# EAGLE design Circuit (EAGLE 6.4)
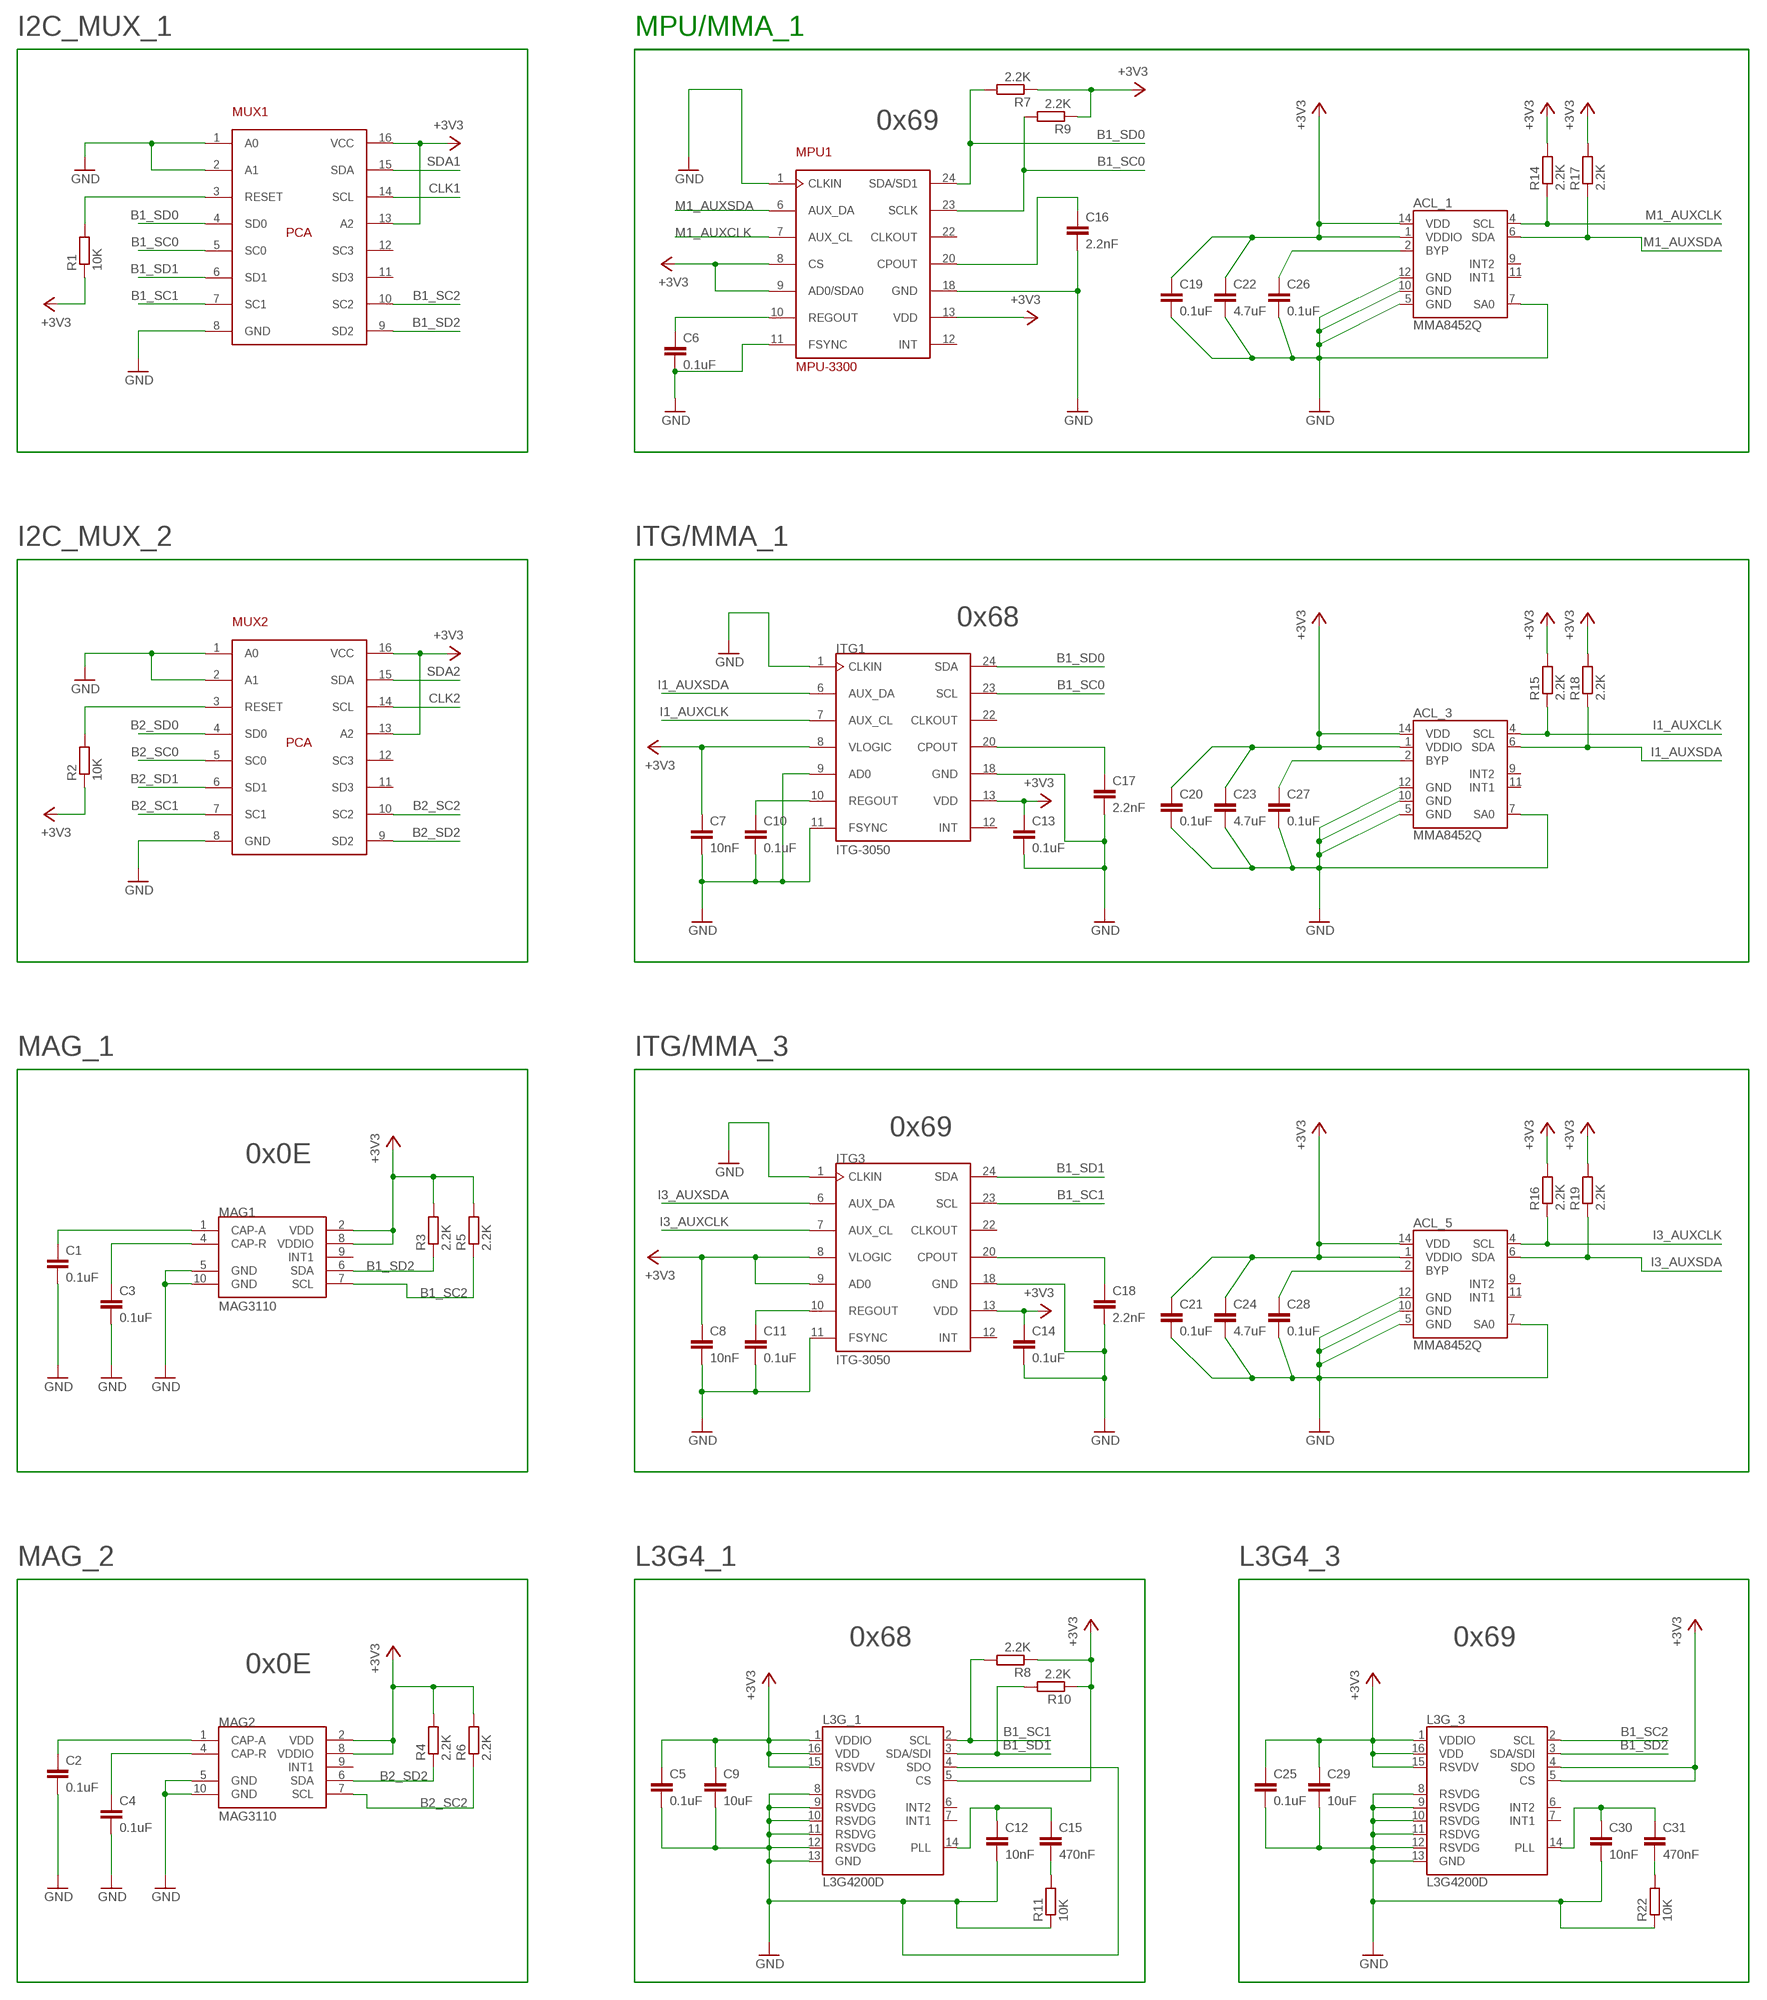
[diagram p0: schematic, sheet 1, part 1 of 2]
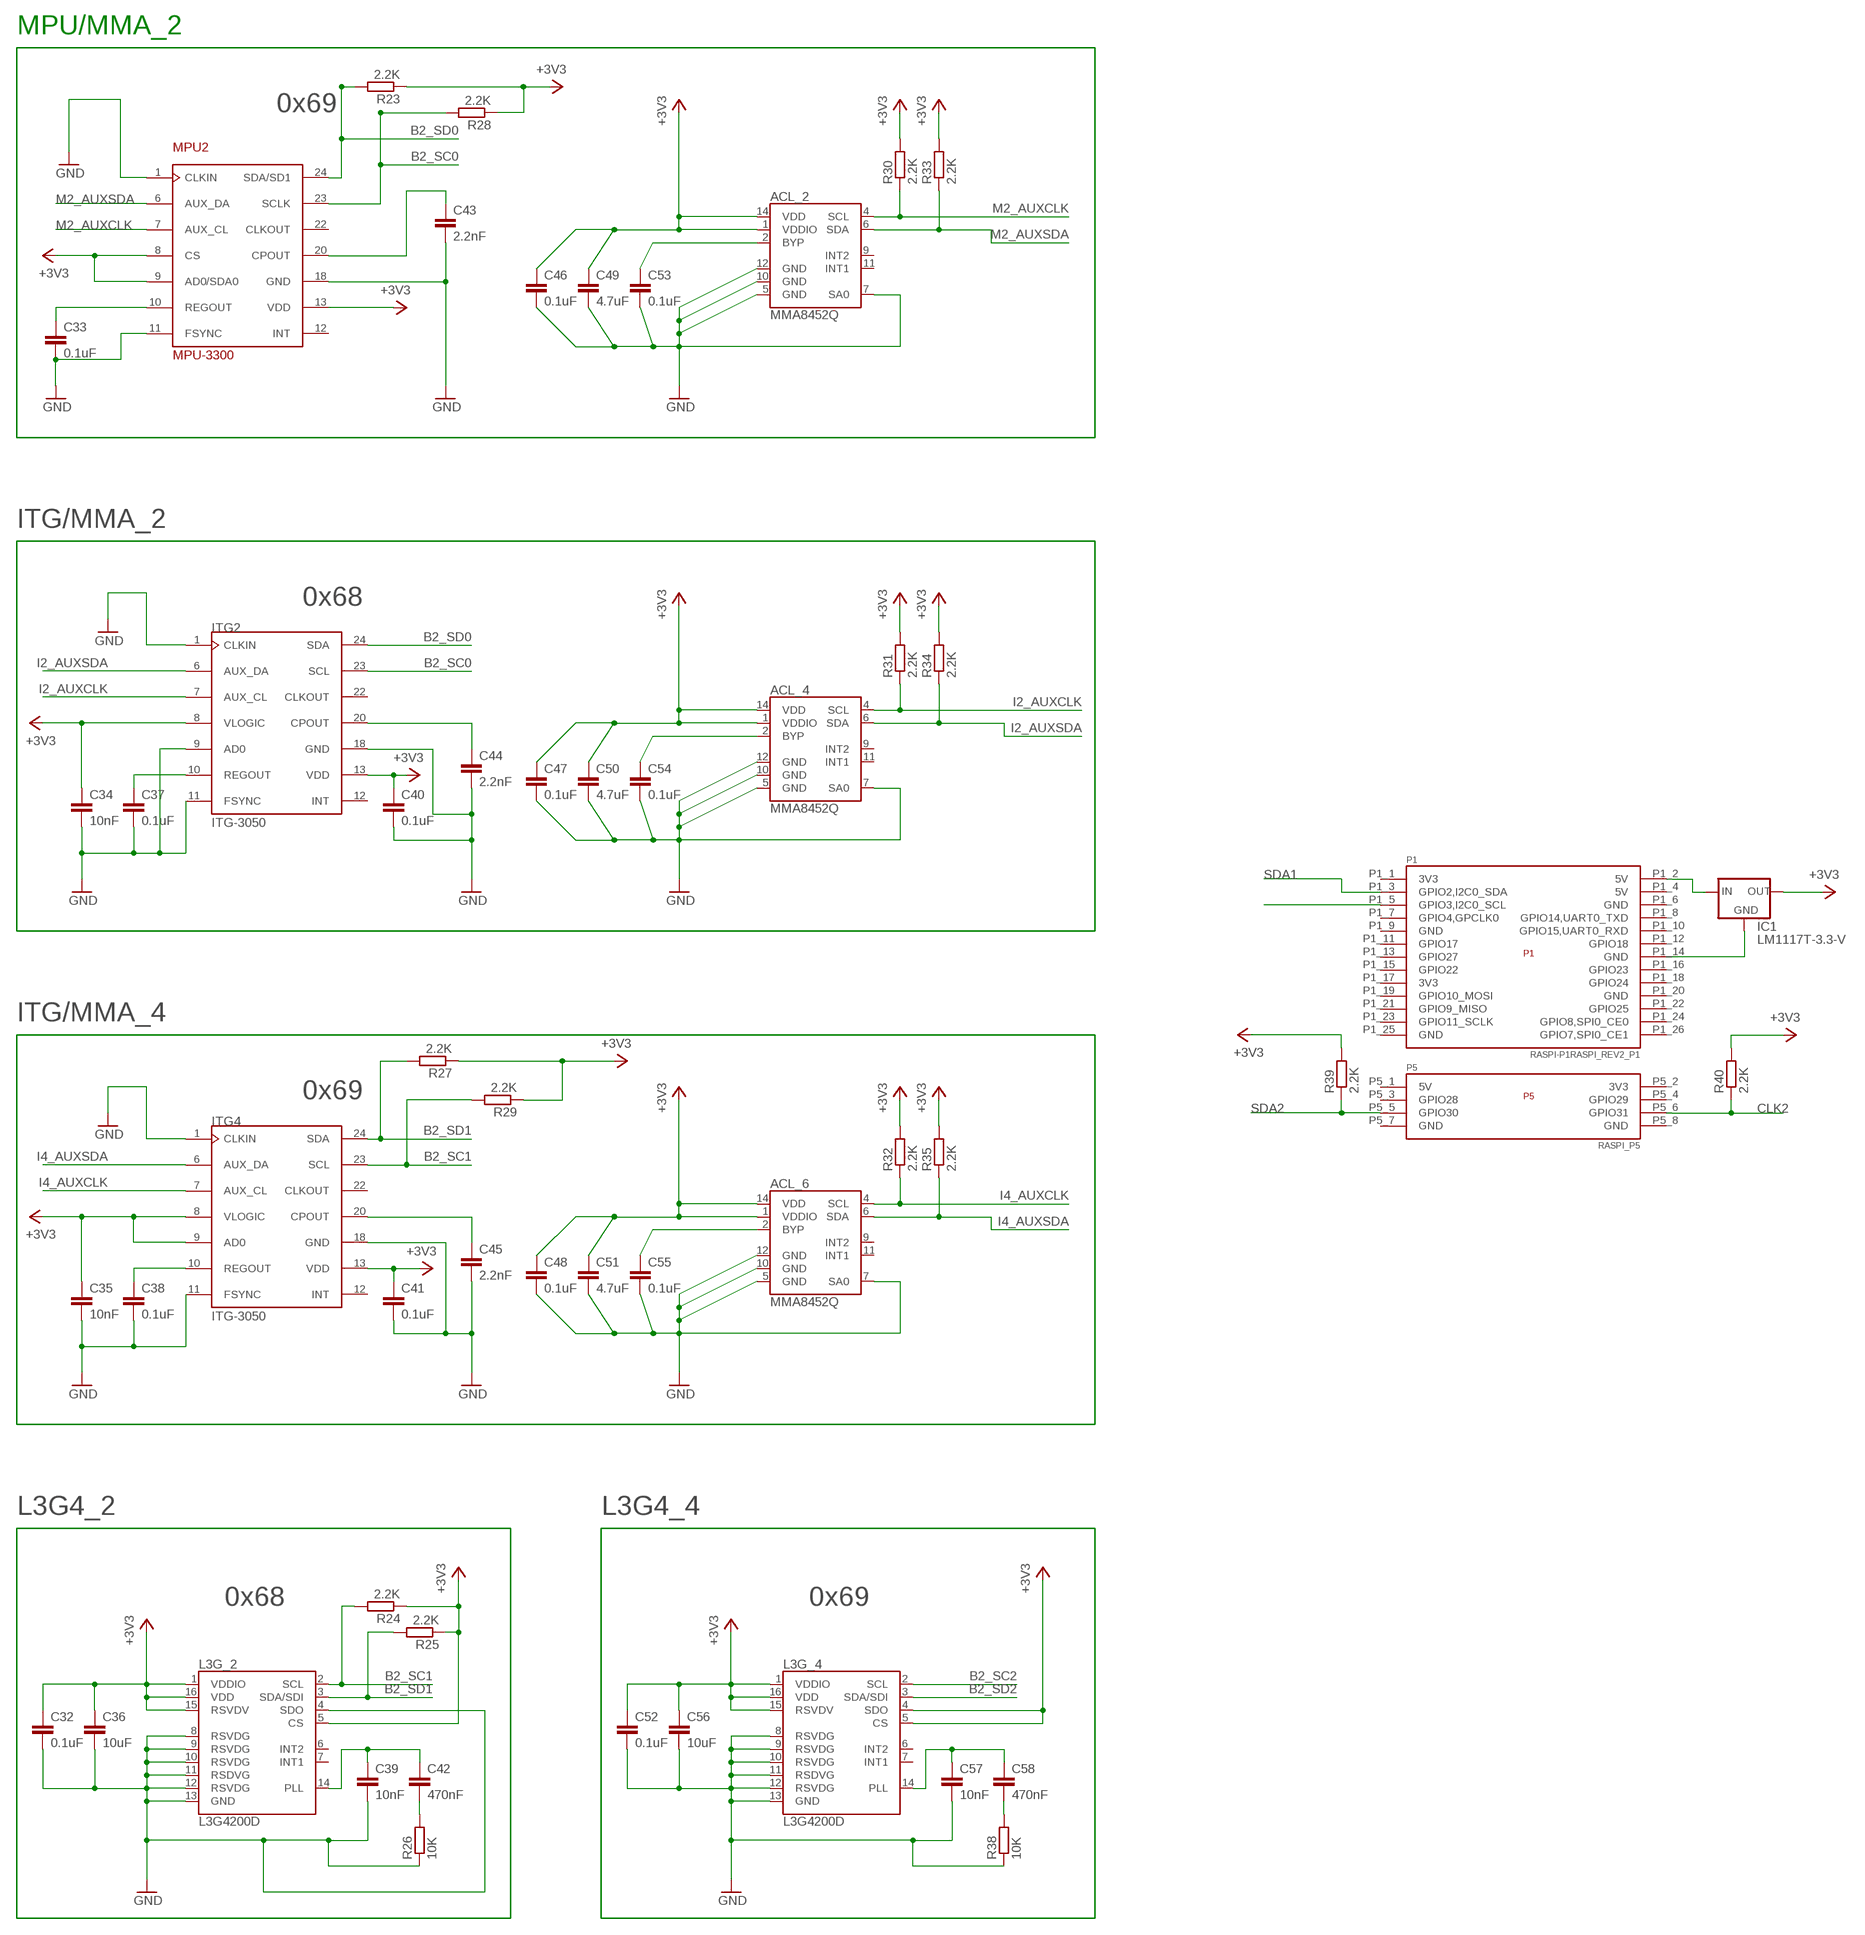
[diagram p1: schematic, sheet 1, part 2 of 2]

## Parts
ACL_1  MMA8452Q  [QFN-16_0.5MM]
ACL_2  MMA8452Q  [QFN-16_0.5MM]
ACL_3  MMA8452Q  [QFN-16_0.5MM]
ACL_4  MMA8452Q  [QFN-16_0.5MM]
ACL_5  MMA8452Q  [QFN-16_0.5MM]
ACL_6  MMA8452Q  [QFN-16_0.5MM]
C1  0.1uF  CAP0603-CAP  [0603-CAP]
C2  0.1uF  CAP0603-CAP  [0603-CAP]
C3  0.1uF  CAP0603-CAP  [0603-CAP]
C4  0.1uF  CAP0603-CAP  [0603-CAP]
C5  0.1uF  CAP0603-CAP  [0603-CAP]
C6  0.1uF  CAP0603-CAP  [0603-CAP]
C7  10nF  CAP0603-CAP  [0603-CAP]
C8  10nF  CAP0603-CAP  [0603-CAP]
C9  10uF  CAP0603-CAP  [0603-CAP]
C10  0.1uF  CAP0603-CAP  [0603-CAP]
C11  0.1uF  CAP0603-CAP  [0603-CAP]
C12  10nF  CAP0603-CAP  [0603-CAP]
C13  0.1uF  CAP0603-CAP  [0603-CAP]
C14  0.1uF  CAP0603-CAP  [0603-CAP]
C15  470nF  CAP0603-CAP  [0603-CAP]
C16  2.2nF  CAP0603-CAP  [0603-CAP]
C17  2.2nF  CAP0603-CAP  [0603-CAP]
C18  2.2nF  CAP0603-CAP  [0603-CAP]
C19  0.1uF  CAP0603-CAP  [0603-CAP]
C20  0.1uF  CAP0603-CAP  [0603-CAP]
C21  0.1uF  CAP0603-CAP  [0603-CAP]
C22  4.7uF  CAP0603-CAP  [0603-CAP]
C23  4.7uF  CAP0603-CAP  [0603-CAP]
C24  4.7uF  CAP0603-CAP  [0603-CAP]
C25  0.1uF  CAP0603-CAP  [0603-CAP]
C26  0.1uF  CAP0603-CAP  [0603-CAP]
C27  0.1uF  CAP0603-CAP  [0603-CAP]
C28  0.1uF  CAP0603-CAP  [0603-CAP]
C29  10uF  CAP0603-CAP  [0603-CAP]
C30  10nF  CAP0603-CAP  [0603-CAP]
C31  470nF  CAP0603-CAP  [0603-CAP]
C32  0.1uF  CAP0603-CAP  [0603-CAP]
C33  0.1uF  CAP0603-CAP  [0603-CAP]
C34  10nF  CAP0603-CAP  [0603-CAP]
C35  10nF  CAP0603-CAP  [0603-CAP]
C36  10uF  CAP0603-CAP  [0603-CAP]
C37  0.1uF  CAP0603-CAP  [0603-CAP]
C38  0.1uF  CAP0603-CAP  [0603-CAP]
C39  10nF  CAP0603-CAP  [0603-CAP]
C40  0.1uF  CAP0603-CAP  [0603-CAP]
C41  0.1uF  CAP0603-CAP  [0603-CAP]
C42  470nF  CAP0603-CAP  [0603-CAP]
C43  2.2nF  CAP0603-CAP  [0603-CAP]
C44  2.2nF  CAP0603-CAP  [0603-CAP]
C45  2.2nF  CAP0603-CAP  [0603-CAP]
C46  0.1uF  CAP0603-CAP  [0603-CAP]
C47  0.1uF  CAP0603-CAP  [0603-CAP]
C48  0.1uF  CAP0603-CAP  [0603-CAP]
C49  4.7uF  CAP0603-CAP  [0603-CAP]
C50  4.7uF  CAP0603-CAP  [0603-CAP]
C51  4.7uF  CAP0603-CAP  [0603-CAP]
C52  0.1uF  CAP0603-CAP  [0603-CAP]
C53  0.1uF  CAP0603-CAP  [0603-CAP]
C54  0.1uF  CAP0603-CAP  [0603-CAP]
C55  0.1uF  CAP0603-CAP  [0603-CAP]
C56  10uF  CAP0603-CAP  [0603-CAP]
C57  10nF  CAP0603-CAP  [0603-CAP]
C58  470nF  CAP0603-CAP  [0603-CAP]
IC1  LM1117T-3.3-V  [TO220V]
ITG1  ITG-3050  [QFN-24-4MM2]
ITG2  ITG-3050  [QFN-24-4MM2]
ITG3  ITG-3050  [QFN-24-4MM2]
ITG4  ITG-3050  [QFN-24-4MM2]
L3G_1  L3G4200D  [LGA16-4X4]
L3G_2  L3G4200D  [LGA16-4X4]
L3G_3  L3G4200D  [LGA16-4X4]
L3G_4  L3G4200D  [LGA16-4X4]
MAG1  MAG3110  [DFN-10]
MAG2  MAG3110  [DFN-10]
MPU1  MPU-3300  [QFN-24-4MM2]
MPU2  MPU-3300  [QFN-24-4MM2]
MUX1  PCA9546A  [TSSOP16]
MUX2  PCA9546A  [TSSOP16]
P1  RASPI-P1RASPI_REV2_P1  [RASPBERRY-PI_REV2]
P5  RASPI_P5  [RASPI_P5]
R1  10K  R-EU_R0603  [R0603]
R2  10K  R-EU_R0603  [R0603]
R3  2.2K  R-EU_R0603  [R0603]
R4  2.2K  R-EU_R0603  [R0603]
R5  2.2K  R-EU_R0603  [R0603]
R6  2.2K  R-EU_R0603  [R0603]
R7  2.2K  R-EU_R0603  [R0603]
R8  2.2K  R-EU_R0603  [R0603]
R9  2.2K  R-EU_R0603  [R0603]
R10  2.2K  R-EU_R0603  [R0603]
R11  10K  R-EU_R0603  [R0603]
R14  2.2K  R-EU_R0603  [R0603]
R15  2.2K  R-EU_R0603  [R0603]
R16  2.2K  R-EU_R0603  [R0603]
R17  2.2K  R-EU_R0603  [R0603]
R18  2.2K  R-EU_R0603  [R0603]
R19  2.2K  R-EU_R0603  [R0603]
R22  10K  R-EU_R0603  [R0603]
R23  2.2K  R-EU_R0603  [R0603]
R24  2.2K  R-EU_R0603  [R0603]
R25  2.2K  R-EU_R0603  [R0603]
R26  10K  R-EU_R0603  [R0603]
R27  2.2K  R-EU_R0603  [R0603]
R28  2.2K  R-EU_R0603  [R0603]
R29  2.2K  R-EU_R0603  [R0603]
R30  2.2K  R-EU_R0603  [R0603]
R31  2.2K  R-EU_R0603  [R0603]
R32  2.2K  R-EU_R0603  [R0603]
R33  2.2K  R-EU_R0603  [R0603]
R34  2.2K  R-EU_R0603  [R0603]
R35  2.2K  R-EU_R0603  [R0603]
R38  10K  R-EU_R0603  [R0603]
R39  2.2K  R-EU_R0603  [R0603]
R40  2.2K  R-EU_R0603  [R0603]

## Nets
+3V3: ACL_1.1(VDDIO) ACL_1.14(VDD) ACL_2.1(VDDIO) ACL_2.14(VDD) ACL_3.1(VDDIO) ACL_3.14(VDD) ACL_4.1(VDDIO) ACL_4.14(VDD) ACL_5.1(VDDIO) ACL_5.14(VDD) ACL_6.1(VDDIO) ACL_6.14(VDD) C5.1 C7.1 C8.1 C9.1 C13.1 C14.1 C19.1 C20.1 C21.1 C22.1 C23.1 C24.1 C25.1 C29.1 C32.1 C34.1 C35.1 C36.1 C40.1 C41.1 C46.1 C47.1 C48.1 C49.1 C50.1 C51.1 C52.1 C56.1 IC1.2(OUT) ITG1.8(VLOGIC) ITG1.13(VDD) ITG2.8(VLOGIC) ITG2.13(VDD) ITG3.8(VLOGIC) ITG3.9(AD0) ITG3.13(VDD) ITG4.8(VLOGIC) ITG4.9(AD0) ITG4.13(VDD) L3G_1.1(VDDIO) L3G_1.5(CS) L3G_1.15(RSVDV) L3G_1.16(VDD) L3G_2.1(VDDIO) L3G_2.5(CS) L3G_2.15(RSVDV) L3G_2.16(VDD) L3G_3.1(VDDIO) L3G_3.4(SDO) L3G_3.5(CS) L3G_3.15(RSVDV) L3G_3.16(VDD) L3G_4.1(VDDIO) L3G_4.4(SDO) L3G_4.5(CS) L3G_4.15(RSVDV) L3G_4.16(VDD) MAG1.2(VDD) MAG1.8(VDDIO) MAG2.2(VDD) MAG2.8(VDDIO) MPU1.8(CS) MPU1.9(AD0/SDA0) MPU1.13(VDD) MPU2.8(CS) MPU2.9(AD0/SDA0) MPU2.13(VDD) MUX1.13(A2) MUX1.16(VCC) MUX2.13(A2) MUX2.16(VCC) R1.1 R2.1 R3.2 R4.2 R5.2 R6.2 R7.1 R8.1 R9.1 R10.1 R14.2 R15.2 R16.2 R17.2 R18.2 R19.2 R23.1 R24.1 R25.1 R27.1 R28.1 R29.1 R30.2 R31.2 R32.2 R33.2 R34.2 R35.2 R39.2 R40.2
B1_SC0: ITG1.23(SCL) MPU1.23(SCLK) MUX1.5(SC0) R9.2
B1_SC1: ITG3.23(SCL) L3G_1.2(SCL) MUX1.7(SC1) R8.2
B1_SC2: L3G_3.2(SCL) MAG1.7(SCL) MUX1.10(SC2) R5.1
B1_SD0: ITG1.24(SDA) MPU1.24(SDA/SD1) MUX1.4(SD0) R7.2
B1_SD1: ITG3.24(SDA) L3G_1.3(SDA/SDI) MUX1.6(SD1) R10.2
B1_SD2: L3G_3.3(SDA/SDI) MAG1.6(SDA) MUX1.9(SD2) R3.1
B2_SC0: ITG2.23(SCL) MPU2.23(SCLK) MUX2.5(SC0) R28.2
B2_SC1: ITG4.23(SCL) L3G_2.2(SCL) MUX2.7(SC1) R24.2 R29.2
B2_SC2: L3G_4.2(SCL) MAG2.7(SCL) MUX2.10(SC2) R6.1
B2_SD0: ITG2.24(SDA) MPU2.24(SDA/SD1) MUX2.4(SD0) R23.2
B2_SD1: ITG4.24(SDA) L3G_2.3(SDA/SDI) MUX2.6(SD1) R25.2 R27.2
B2_SD2: L3G_4.3(SDA/SDI) MAG2.6(SDA) MUX2.9(SD2) R4.1
CLK1: MUX1.14(SCL) P1.P1_5(GPIO3,I2C0_SCL)
CLK2: MUX2.14(SCL) P5.P5_6(GPIO31) R40.1
GND: ACL_1.5(GND) ACL_1.7(SA0) ACL_1.10(GND) ACL_1.12(GND) ACL_2.5(GND) ACL_2.7(SA0) ACL_2.10(GND) ACL_2.12(GND) ACL_3.5(GND) ACL_3.7(SA0) ACL_3.10(GND) ACL_3.12(GND) ACL_4.5(GND) ACL_4.7(SA0) ACL_4.10(GND) ACL_4.12(GND) ACL_5.5(GND) ACL_5.7(SA0) ACL_5.10(GND) ACL_5.12(GND) ACL_6.5(GND) ACL_6.7(SA0) ACL_6.10(GND) ACL_6.12(GND) C1.2 C2.2 C3.2 C4.2 C5.2 C6.2 C7.2 C8.2 C9.2 C10.2 C11.2 C12.2 C13.2 C14.2 C16.2 C17.2 C18.2 C19.2 C20.2 C21.2 C22.2 C23.2 C24.2 C25.2 C26.2 C27.2 C28.2 C29.2 C30.2 C32.2 C33.2 C34.2 C35.2 C36.2 C37.2 C38.2 C39.2 C40.2 C41.2 C43.2 C44.2 C45.2 C46.2 C47.2 C48.2 C49.2 C50.2 C51.2 C52.2 C53.2 C54.2 C55.2 C56.2 C57.2 IC1.1(GND) ITG1.1(CLKIN) ITG1.9(AD0) ITG1.11(FSYNC) ITG1.18(GND) ITG2.1(CLKIN) ITG2.9(AD0) ITG2.11(FSYNC) ITG2.18(GND) ITG3.1(CLKIN) ITG3.11(FSYNC) ITG3.18(GND) ITG4.1(CLKIN) ITG4.11(FSYNC) ITG4.18(GND) L3G_1.4(SDO) L3G_1.8(RSVDG) L3G_1.9(RSVDG) L3G_1.10(RSVDG) L3G_1.11(RSDVG) L3G_1.12(RSVDG) L3G_1.13(GND) L3G_2.4(SDO) L3G_2.8(RSVDG) L3G_2.9(RSVDG) L3G_2.10(RSVDG) L3G_2.11(RSDVG) L3G_2.12(RSVDG) L3G_2.13(GND) L3G_3.8(RSVDG) L3G_3.9(RSVDG) L3G_3.10(RSVDG) L3G_3.11(RSDVG) L3G_3.12(RSVDG) L3G_3.13(GND) L3G_4.8(RSVDG) L3G_4.9(RSVDG) L3G_4.10(RSVDG) L3G_4.11(RSDVG) L3G_4.12(RSVDG) L3G_4.13(GND) MAG1.5(GND) MAG1.10(GND) MAG2.5(GND) MAG2.10(GND) MPU1.1(CLKIN) MPU1.11(FSYNC) MPU1.18(GND) MPU2.1(CLKIN) MPU2.11(FSYNC) MPU2.18(GND) MUX1.1(A0) MUX1.2(A1) MUX1.8(GND) MUX2.1(A0) MUX2.2(A1) MUX2.8(GND) P1.P1_14(GND) R11.1 R22.1 R26.1 R38.1
I1_AUXCLK: ACL_3.4(SCL) ITG1.7(AUX_CL) R15.1
I1_AUXSDA: ACL_3.6(SDA) ITG1.6(AUX_DA) R18.1
I2_AUXCLK: ACL_4.4(SCL) ITG2.7(AUX_CL) R31.1
I2_AUXSDA: ACL_4.6(SDA) ITG2.6(AUX_DA) R34.1
I3_AUXCLK: ACL_5.4(SCL) ITG3.7(AUX_CL) R16.1
I3_AUXSDA: ACL_5.6(SDA) ITG3.6(AUX_DA) R19.1
I4_AUXCLK: ACL_6.4(SCL) ITG4.7(AUX_CL) R32.1
I4_AUXSDA: ACL_6.6(SDA) ITG4.6(AUX_DA) R35.1
M1_AUXCLK: ACL_1.4(SCL) MPU1.7(AUX_CL) R14.1
M1_AUXSDA: ACL_1.6(SDA) MPU1.6(AUX_DA) R17.1
M2_AUXCLK: ACL_2.4(SCL) MPU2.7(AUX_CL) R30.1
M2_AUXSDA: ACL_2.6(SDA) MPU2.6(AUX_DA) R33.1
N$1: C16.1 MPU1.20(CPOUT)
N$2: C6.1 MPU1.10(REGOUT)
N$3: ACL_1.2(BYP) C26.1
N$5: ACL_2.2(BYP) C53.1
N$6: C43.1 MPU2.20(CPOUT)
N$7: C33.1 MPU2.10(REGOUT)
N$9: ACL_3.2(BYP) C27.1
N$10: IC1.3(IN) P1.P1_2(5V)
N$13: C10.1 ITG1.10(REGOUT)
N$14: C17.1 ITG1.20(CPOUT)
N$15: ACL_4.2(BYP) C54.1
N$16: MUX2.3(RESET) R2.2
N$20: C37.1 ITG2.10(REGOUT)
N$21: C44.1 ITG2.20(CPOUT)
N$23: ACL_5.2(BYP) C28.1
N$27: C11.1 ITG3.10(REGOUT)
N$28: C18.1 ITG3.20(CPOUT)
N$30: ACL_6.2(BYP) C55.1
N$34: C38.1 ITG4.10(REGOUT)
N$35: C45.1 ITG4.20(CPOUT)
N$36: C30.1 C31.1 L3G_3.14(PLL)
N$38: C2.1 MAG2.1(CAP-A)
N$39: C12.1 C15.1 L3G_1.14(PLL)
N$40: C15.2 R11.2
N$41: C31.2 R22.2
N$42: MUX1.3(RESET) R1.2
N$45: C39.1 C42.1 L3G_2.14(PLL)
N$46: C42.2 R26.2
N$49: C4.1 MAG2.4(CAP-R)
N$50: C57.1 C58.1 L3G_4.14(PLL)
N$51: C58.2 R38.2
N$52: C1.1 MAG1.1(CAP-A)
N$53: C3.1 MAG1.4(CAP-R)
SDA1: MUX1.15(SDA) P1.P1_3(GPIO2,I2C0_SDA)
SDA2: MUX2.15(SDA) P5.P5_5(GPIO30) R39.1
Unconnected: ACL_1.9(INT2) ACL_1.11(INT1) ACL_2.9(INT2) ACL_2.11(INT1) ACL_3.9(INT2) ACL_3.11(INT1) ACL_4.9(INT2) ACL_4.11(INT1) ACL_5.9(INT2) ACL_5.11(INT1) ACL_6.9(INT2) ACL_6.11(INT1) ITG1.12(INT) ITG1.22(CLKOUT) ITG2.12(INT) ITG2.22(CLKOUT) ITG3.12(INT) ITG3.22(CLKOUT) ITG4.12(INT) ITG4.22(CLKOUT) L3G_1.6(INT2) L3G_1.7(INT1) L3G_2.6(INT2) L3G_2.7(INT1) L3G_3.6(INT2) L3G_3.7(INT1) L3G_4.6(INT2) L3G_4.7(INT1) MAG1.9(INT1) MAG2.9(INT1) MPU1.12(INT) MPU1.22(CLKOUT) MPU2.12(INT) MPU2.22(CLKOUT) MUX1.11(SD3) MUX1.12(SC3) MUX2.11(SD3) MUX2.12(SC3) P1.P1_1(3V3) P1.P1_4(5V) P1.P1_6(GND) P1.P1_7(GPIO4,GPCLK0) P1.P1_8(GPIO14,UART0_TXD) P1.P1_9(GND) P1.P1_10(GPIO15,UART0_RXD) P1.P1_11(GPIO17) P1.P1_12(GPIO18) P1.P1_13(GPIO27) P1.P1_15(GPIO22) P1.P1_16(GPIO23) P1.P1_17(3V3) P1.P1_18(GPIO24) P1.P1_19(GPIO10_MOSI) P1.P1_20(GND) P1.P1_21(GPIO9_MISO) P1.P1_22(GPIO25) P1.P1_23(GPIO11_SCLK) P1.P1_24(GPIO8,SPI0_CE0) P1.P1_25(GND) P1.P1_26(GPIO7,SPI0_CE1) P5.P5_1(5V) P5.P5_2(3V3) P5.P5_3(GPIO28) P5.P5_4(GPIO29) P5.P5_7(GND) P5.P5_8(GND)

## Notes on the sheet
- MPU/MMA_1 | MPU/MMA_2
- 0x69
- 0x69
- 0x68 | 0x68
- 0x69 | 0x69
- 0x0E
- 0x68 | 0x69
- 0x68 | 0x69
- 0x0E

## Library data of the parts
ACL_1-ACL_6 = SparkFun:MMA8452Q: MMA8452Q 3-Axis, 12/8-bit Digital Accelerometer Supply Voltage: 1.6-3.6V Range: +/- 2g, 4g, 8g Interface: I2C, 12-bit and 8-bit ODR: 1.56 Hz - 800 Hz Package: QFN-16 http://cache.freescale.com/files/sensors/doc/data_sheet/MMA8452Q.pdf
C1-C58 = SparkFun:CAP: Capacitor Standard 0603 ceramic capacitor, and 0.1" leaded capacitor.
IC1 = Gyros:LM1117T-*
ITG1-ITG4 = Gyros:ITG-3050: Device for the ITG-3050 gyroscope
L3G_1-L3G_4 = SparkFun:L3G4200D: L3G4200D Three-axis, digital output gyroscope The L3G4200D is a low-power three-axis angular rate sensor, has a full scale of ±250/±500/±2000 dps and is capable of measuring rates with a user-selectable bandwidth. It includes a sensing element and an IC interface capable of providing the measured angular rate to the external world through a digital interface (I2C/SPI). Package: 4x4x1.1 LGA-16 (LGA16-4x4.PAC)
MAG1 MAG2 = Gyros:MAG3110: 3-axis digital (I2C) magnetometer
MPU1 MPU2 = Gyros:MPU-3300: MPU3300 device plan
MUX1 MUX2 = Gyros:PCA9546A
P1 = Gyros:RASPI-P1: Raspberry Pi Board <http://www.raspberrypi.org/> Jacques Lagnel V1.0 (beta) 2012 Mateusz Bawaj V1.1 (beta) 2012 Board dimension: Forum 3D model <http://www.raspberrypi.org/forum/general-discussion/mechanical-profile-3d-models?value=3d%20model&type=1&include=1&search=1&ret=all> The GPIO Connector (P1): http://elinux.org/RPi_Low-level_peripherals The GPIO Connector (P5): http://www.raspberrypi-spy.co.uk/2012/09/raspberry-pi-p5-header/
P5 = RaspberryPi:RASPI_P5: Raspberry Pi Board <http://www.raspberrypi.org/> Jacques Lagnel V1.0 (beta) 2012 Mateusz Bawaj V1.1 (beta) 2012 Board dimension: Forum 3D model <http://www.raspberrypi.org/forum/general-discussion/mechanical-profile-3d-models?value=3d%20model&type=1&include=1&search=1&ret=all> The GPIO Connector (P1): http://elinux.org/RPi_Low-level_peripherals The GPIO Connector (P5): http://www.raspberrypi-spy.co.uk/2012/09/raspberry-pi-p5-header/
R1-R11 R14-R19 R22-R35 R38-R40 = resistor:R-EU_: RESISTOR, European symbol

## Board
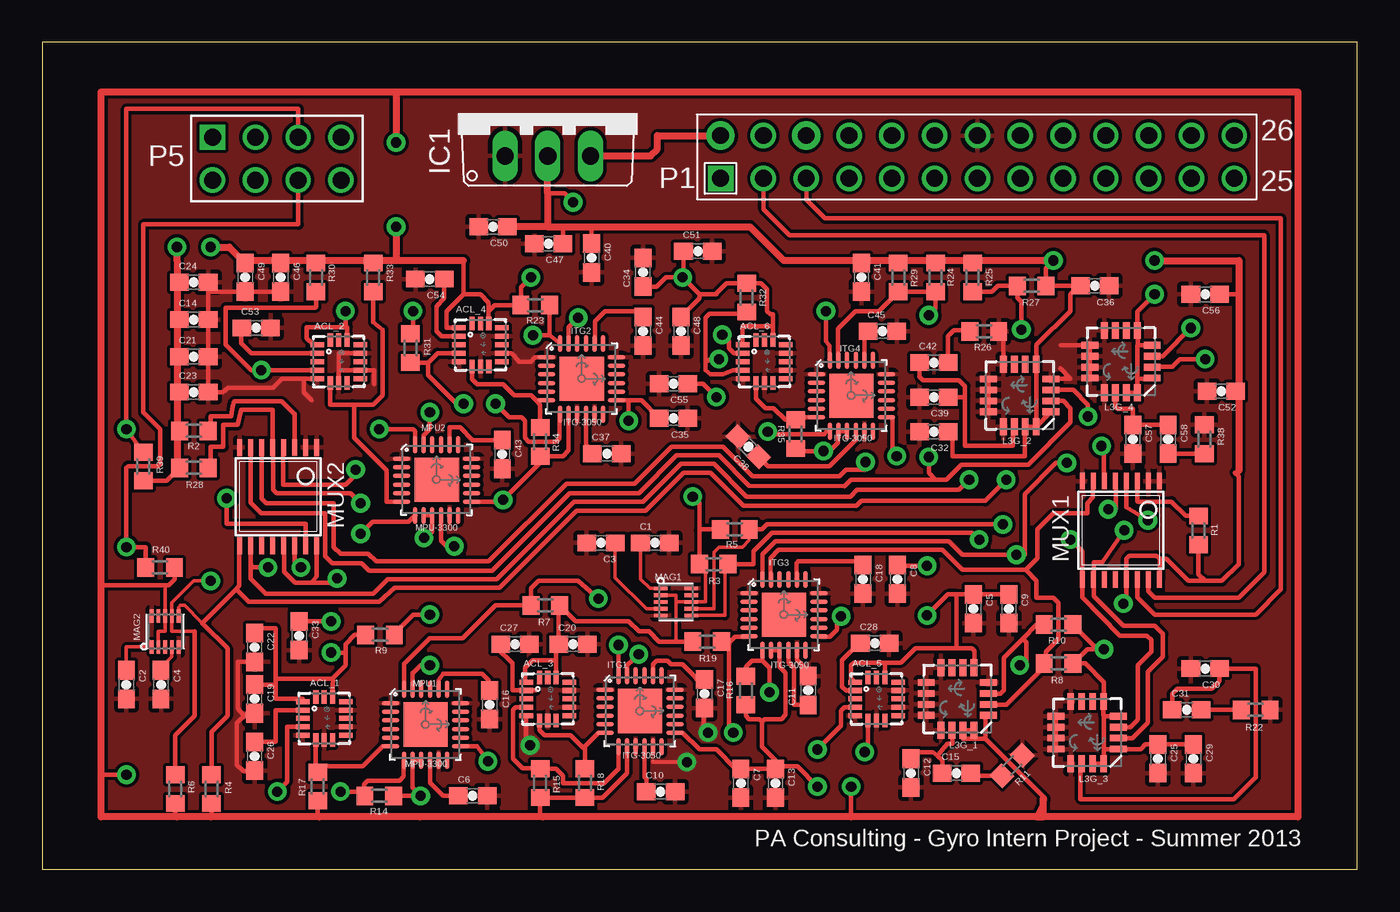
[diagram p2: board, top side]
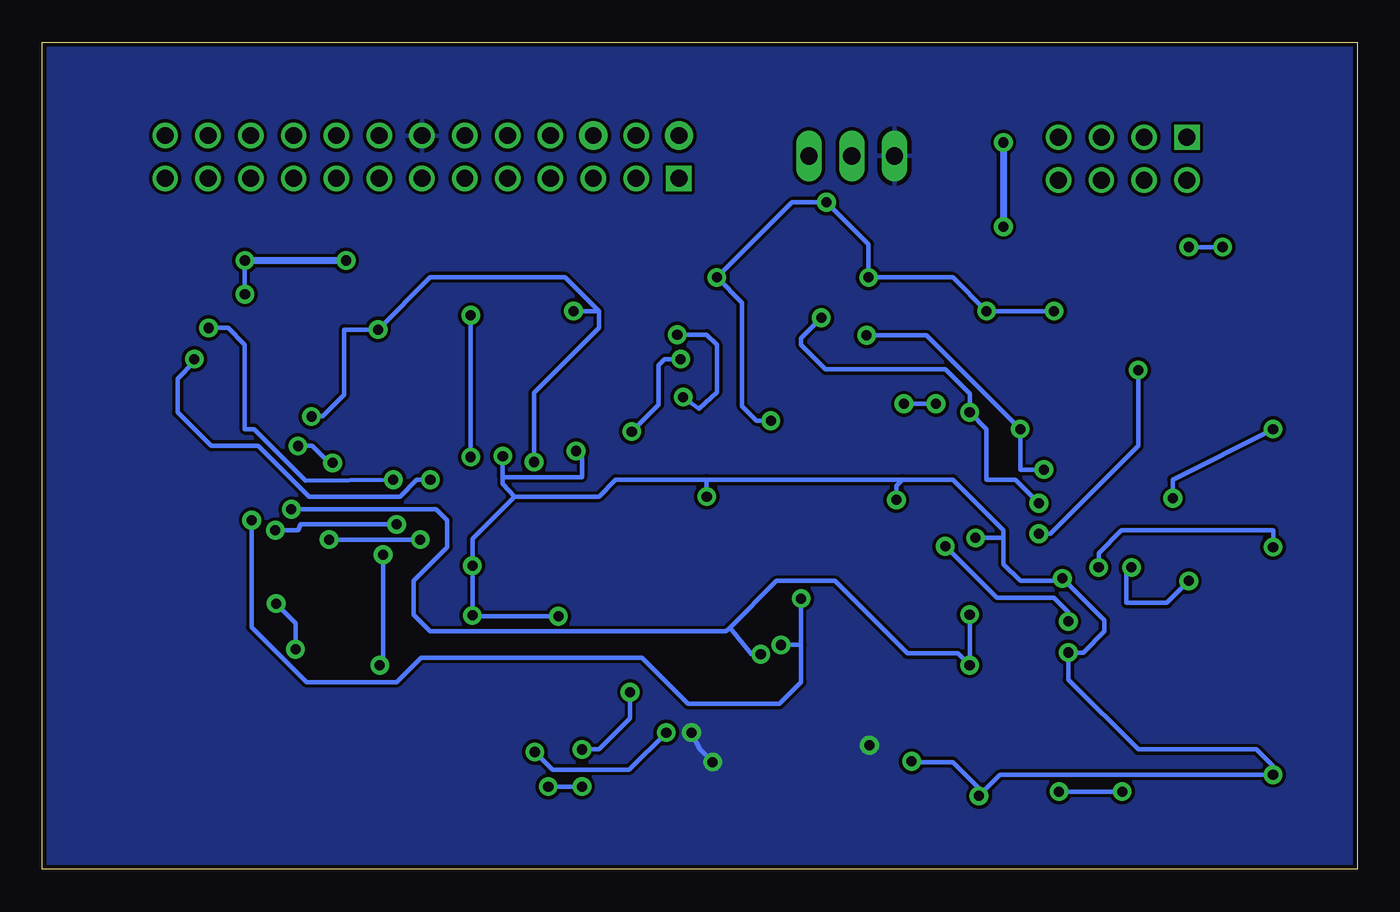
[diagram p3: board, bottom side, seen from below]

Size 78.03 x 49.06 mm. Coordinates in mm from the lower left corner, seen from the top.
Outline: 0,0 78.03,0 78.03,49.06 0,49.06 0,0
Copper layers (1*16): Top 0.035mm / dielectric 1.5mm / Bottom 0.035mm
Design rules "pcbtrain": minimum track width 0.2mm, minimum drill 0.4mm, track to track 0.2mm, track to pad 0.2mm, pad to pad 0.2mm, via to via 0.2mm, smd to smd 0mil, copper to edge 10mil, drill to drill 0.2mm, minimum pad ring 10mil, minimum via ring 10mil, stop-mask expansion 0.125mm, vias tented up to drill 0mil, thermal gap 10mil

### Footprints (pad centres in the part's own frame; a part is rotated, then mirrored left to right if it is on the bottom)
QFN-16_0.5MM = smd 0.8 x 0.3: 1 -1.275,1; 2 -1.275,0.5; 3 -1.275,0; 4 -1.275,-0.5; 5 -1.275,-1; 9 1.275,-1; 10 1.275,-0.5; 11 1.275,0; 12 1.275,0.5; 13 1.275,1 | smd 0.3 x 0.8: 6 -0.5,-1.275; 7 0,-1.275; 8 0.5,-1.275; 14 0.5,1.275; 15 0,1.275; 16 -0.5,1.275
0603-CAP = smd 1.1 x 1: 1 -0.85,0; 2 0.85,0
TO220V = drill 1.016 long: 1 -2.54,-2.54; 2 0,-2.54; 3 2.54,-2.54
QFN-24-4MM2 = smd 1.016 x 0.254: 1 -2.066,1.257; 2 -2.066,0.75; 3 -2.066,0.247; 4 -2.066,-0.287; 5 -2.066,-0.792; 6 -2.066,-1.297; 13 2.086,-1.297; 14 2.086,-0.792; 15 2.086,-0.287; 16 2.086,0.247; 17 2.086,0.75; 18 2.086,1.257 | smd 0.254 x 1.016: 7 -1.267,-2.122; 8 -0.762,-2.122; 9 -0.258,-2.122; 10 0.278,-2.122; 11 0.78,-2.122; 12 1.287,-2.122; 19 1.287,2.082; 20 0.78,2.082; 21 0.278,2.082; 22 -0.258,2.082; 23 -0.762,2.082; 24 -1.267,2.082 | smd 2.616 x 2.616: P$1 0.02,-0.01
LGA16-4X4 = smd 1 x 0.4: 1 -1.85,0.975; 2 -1.85,0.325; 3 -1.85,-0.325; 4 -1.85,-0.975; 9 1.85,-0.975; 10 1.85,-0.325; 11 1.85,0.325; 12 1.85,0.975 | smd 0.4 x 1: 5 -0.975,-1.85; 6 -0.325,-1.85; 7 0.325,-1.85; 8 0.975,-1.85; 13 0.975,1.85; 14 0.325,1.85; 15 -0.325,1.85; 16 -0.975,1.85
DFN-10 = smd 0.8 x 0.22: 1 -0.91,0.8; 2 -0.91,0.4; 3 -0.91,0; 4 -0.91,-0.4; 5 -0.91,-0.8; 6 0.91,-0.8; 7 0.91,-0.4; 8 0.91,0; 9 0.91,0.4; 10 0.91,0.8
TSSOP16 = smd 0.305 x 0.991: 1 -2.275,-2.918; 2 -1.625,-2.918; 3 -0.975,-2.918; 4 -0.325,-2.918; 5 0.325,-2.918; 6 0.975,-2.918; 7 1.625,-2.918; 8 2.275,-2.918; 9 2.275,2.918; 10 1.625,2.918; 11 0.975,2.918; 12 0.325,2.918; 13 -0.325,2.918; 14 -0.975,2.918; 15 -1.625,2.918; 16 -2.275,2.918
RASPBERRY-PI_REV2 = drill 1 square: P1_1 -31.75,1.27 | drill 1 pad 1.676: P1_2 -31.75,3.81; P1_6 -26.67,3.81 | drill 1: P1_3 -29.21,1.27; P1_4 -29.21,3.81; P1_5 -26.67,1.27; P1_7 -24.13,1.27; P1_8 -24.13,3.81; P1_9 -21.59,1.27; P1_10 -21.59,3.81; P1_11 -19.05,1.27; P1_12 -19.05,3.81; P1_13 -16.51,1.27; P1_14 -16.51,3.81; P1_15 -13.97,1.27; P1_16 -13.97,3.81; P1_17 -11.43,1.27; P1_18 -11.43,3.81; P1_19 -8.89,1.27; P1_20 -8.89,3.81; P1_21 -6.35,1.27; P1_22 -6.35,3.81; P1_23 -3.81,1.27; P1_24 -3.81,3.81; P1_25 -1.27,1.27; P1_26 -1.27,3.81
RASPI_P5 = drill 1 square: P5_1 -8.89,3.81 | drill 1: P5_2 -8.89,1.27; P5_3 -6.35,3.81; P5_4 -6.35,1.27; P5_5 -3.81,3.81; P5_6 -3.81,1.27; P5_7 -1.27,3.81; P5_8 -1.27,1.27
R0603 = smd 1 x 1.1: 1 -0.85,0; 2 0.85,0

### Placement (x,y rotation side)
ACL_1  16.74,8.95 0 top
ACL_2  17.6,30.11 0 top
ACL_3  30,10.11 0 top
ACL_4  26,31.11 0 top
ACL_5  49.5,10.11 0 top
ACL_6  42.85,30.11 0 top
C1  36.35,19.36 0 top
C2  5,10.96 270 top
C3  33.15,19.36 180 top
C4  7.05,10.96 270 top
C5  55.25,15.46 270 top
C6  25.55,4.36 0 top
C7  41.45,5.11 270 top
C8  50.75,17.21 270 top
C9  57.35,15.46 270 top
C10  36.7,4.61 0 top
C11  45.45,10.61 90 top
C12  51.55,5.71 270 top
C13  43.5,5.11 270 top
C14  9,32.61 0 top
C15  54.25,5.71 0 top
C16  26.55,9.76 270 top
C17  39.3,10.41 270 top
C18  48.7,17.21 270 top
C19  12.6,10.11 270 top
C20  31.5,13.36 0 top
C21  9,30.41 0 top
C22  12.6,13.16 270 top
C23  9,28.31 0 top
C24  9,34.81 0 top
C25  66.2,6.56 270 top
C26  12.6,6.71 270 top
C27  28.05,13.36 0 top
C28  49.4,13.41 0 top
C29  68.3,6.56 270 top
C30  69,11.91 180 top
C31  67.9,9.46 0 top
C32  52.9,25.96 180 top
C33  15.25,13.86 270 top
C34  35.65,35.41 90 top
C35  37.45,26.76 0 top
C36  62.45,34.61 0 top
C37  33.5,24.66 0 top
C38  41.9,25.06 135.2 top
C39  52.9,28.01 180 top
C40  32.6,36.26 270 top
C41  48.6,35.11 270 top
C42  52.9,30.06 0 top
C43  27.3,24.61 270 top
C44  35.65,31.91 270 top
C45  49.85,31.91 0 top
C46  14.15,35.11 270 top
C47  30.05,37.11 180 top
C48  37.9,31.91 270 top
C49  12.05,35.11 270 top
C50  26.75,38.11 180 top
C51  38.9,36.66 0 top
C52  69.95,28.36 180 top
C53  12.7,32.11 0 top
C54  23,35.01 180 top
C55  37.45,28.81 180 top
C56  69,34.11 180 top
C57  64.7,25.51 270 top
C58  66.8,25.51 270 top
IC1  30,44.85 0 top
ITG1  35.46,9.4 0 top
ITG2  32,29.11 0 top
ITG3  44,15.11 0 top
ITG4  48,28.11 0 top
L3G_1  54.3,10.11 180 top
L3G_2  58,28.11 180 top
L3G_3  62,8.11 180 top
L3G_4  64,30.11 180 top
MAG1  37.6,15.86 0 top
MAG2  7.3,14.11 90 top
MPU1  22.74,8.6 0 top
MPU2  23.4,23.11 0 top
MUX1  64,20.11 180 top
MUX2  14,22.11 180 top
P1  72,39.71 0 top
P5  19,39.61 0 top
R1  68.6,20.11 90 top
R2  9,26.01 0 top
R3  39.85,18.11 180 top
R4  10.05,4.76 270 top
R5  41.1,20.16 180 top
R6  7.9,4.76 270 top
R7  29.85,15.66 180 top
R8  60.3,12.21 180 top
R9  20.05,13.91 0 top
R10  60.3,14.51 180 top
R11  57.55,6.16 225 top
R14  20,4.36 0 top
R15  29.55,5.11 270 top
R16  41.75,10.61 270 top
R17  16.35,4.91 270 top
R18  32.2,5.11 270 top
R19  39.45,13.51 180 top
R22  72,9.46 180 top
R23  29.25,33.46 0 top
R24  53,35.11 270 top
R25  55.2,35.11 270 top
R26  55.9,31.91 180 top
R27  58.7,34.61 180 top
R28  9,23.81 0 top
R29  50.8,35.11 270 top
R30  16.25,35.11 90 top
R31  21.85,30.91 90 top
R32  41.8,33.91 90 top
R33  19.65,35.11 90 top
R34  29.55,25.36 270 top
R35  44.7,25.81 270.1 top
R38  68.95,25.51 270 top
R39  6,23.89 270 top
R40  7,17.91 0 top

### Tracks (layer width: path | path; a pad name or v marks a point on that pad's centre or on a via)
+3V3  (via drill 0.6)
  Top 0.2: MAG2.2 6.9,14.11 7.3,14.11 MAG2.8 7.3,16.86 | MAG1.2 37.6,16.26 37.6,15.86 | 37.6,15.86 37.6,13.51 | 37.6,15.86 MAG1.8 39.35,15.86 39.35,17.71 39,18.06 R3.2
  Top 0.254: ACL_1.14 17.24,10.87 17.25,11.31 17.2,11.31 | 17.2,11.31 13.85,11.31 | C19.1 13.85,10.96 | 13.85,10.96 13.85,10.11 15.46,10.11 ACL_1.1 | 13.85,11.31 13.85,10.96 | R18.2 32,4.11 | R18.2 R15.2 29.55,3.26 29.7,3.11 | ITG3.8 ITG3.9 43.74,12.02 44.1,11.66 44.1,9.16 43.85,8.91 42.85,8.91 42.7,8.76 | 54.25,13.11 51.8,13.11 50.95,12.26 50,12.26 | 54.25,16.31 54.25,13.11 | 54.25,13.11 55.15,13.11 55.3,12.96 55.3,11.98 L3G_1.5 | L3G_1.1 55.98,9.13 55.98,7.74 | C9.1 C5.1 54.25,16.31 | 63,7.11 63.02,7.14 L3G_3.1 65.17,7.14 65.45,7.41 C25.1 C29.1 | 63,7.11 63,6.29 L3G_3.16 L3G_3.15 | L3G_3.4 63.02,9.08 63,9.11 | 63,9.11 63,7.11 | 63,9.11 62.98,9.13 L3G_3.5 63,9.98 63,11.11 61.9,12.21 R8.1 62,13.06 62.6,13.06 | 12.75,14.36 12.8,14.31 13.05,14.31 | 13.85,11.31 13.85,14.31 13.05,14.31 | 59,3.11 59.5,4.11 59.5,4.21 55.98,7.74 | MPU1.8 MPU1.9 | 66.3,18.41 66.1,18.61 64.5,18.61 64.33,18.43 MUX1.13 64.33,15.93 v64.15,15.76 | 66.3,18.41 66.3,17.22 MUX1.16 | L3G_4.15 L3G_4.16 64.97,29.11 | 65.83,31.11 L3G_4.4 65,31.09 | 71,23.66 70.77,23.54 71,23.31 71,18.11 70,17.11 69,17.11 | 55,36.11 53,36.11 | 53,36.11 51,36.11 50.85,35.96 R29.1 | L3G_2.15 58.3,26.23 58.3,24.51 54,24.51 54,26.11 C32.1 | L3G_2.15 L3G_2.16 | 58.3,26.29 L3G_2.15 | ITG4.9 ITG4.8 47.2,25.95 47.2,25.31 46.7,24.81 v46.35,24.81 44.7,24.81 R35.2 | 53.15,35.96 53,36.11 | R24.1 53,36.11 | R25.1 55.15,35.96 55,36.11 | 21,36.11 19,36.11 | 19,36.11 17,36.11 | 26.5,32.61 ACL_4.14 26.5,33.11 | ACL_4.1 24,32.11 24,33.11 25,34.11 | 17,36.11 15,36.11 15,35.96 | R30.2 17,36.11 | R33.2 19.15,35.96 19,36.11 | ACL_2.14 18.1,32.16 | 8,36.11 8,35.11 | 8,35.11 8,33.11 | 8,33.11 8,30.11 | 8,30.11 8,28.11 8.1,28.21 C23.1
  Top 0.254: C21.1 8.15,30.26 8,30.11 | C14.1 8.15,32.96 8,33.11 | C24.1 8.15,34.96 8,35.11 | MPU1.8 22,6.48 | ACL_2.1 16.1,31.11 15.7,31.51 15.7,32.16 18.1,32.16 | 17.2,11.31 18,12.11 18,12.86 | 13.05,14.31 C22.1 12.5,14.11 | MPU2.13 27.25,21.81 v27.35,21.91 29.55,24.11 R34.2 30.9,24.51 31.24,24.85 ITG2.8 | MPU2.8 MPU2.9 23.15,20.01 22.8,19.66 v22.65,19.66 | 38.01,8.1 ITG1.13 38,8.11 39,7.11 40,7.11 41.15,5.96 C7.1 C13.1 | 43.35,32.21 41.55,32.21 41.55,31.13 ACL_6.1 | ITG4.13 50.45,26.81 50.45,24.51 v50.7,24.51 | 55,36.11 58.25,36.11 | 25,36.11 25,34.11 | v17.15,12.86 18,12.86 | 39,20.11 39,21.71 v38.6,22.11 | 39,20.11 R3.2 | C56.1 71,34.11 | MUX2.13 14.35,19.17 14.35,17.66 15,17.01 16,17.01 | 16,17.01 16.27,17.38 MUX2.16 | R39.2 7.38,23.04 R28.1 | 26.5,33.11 26.85,33.46 R23.1 28.4,34.51 v29,35.11 | 30.5,12.41 30.5,13.21 C20.1 30.65,15.71 R7.1 31.65,14.71 34.8,14.71 35.4,14.11 36,14.11 36.6,13.51 37.6,13.51 R19.2 38.15,13.51 | 30.5,12.41 ACL_3.14 | ACL_3.1 28.65,11.18 28.65,11.96 29.1,12.41 30.5,12.41 | 22.48,3.19 22.4,3.11 | v60,36.11 59.55,35.66 R27.1 61.5,34.61 | C41.1 48.85,35.96 49,36.11 | C36.1 61.5,34.61 | 65,31.09 65,31.93 L3G_4.5 64.97,33.09 v66,34.11 | 64.97,29.11 64.97,31.09 65,31.09 | L3G_4.1 65.85,29.11 64.97,29.11 | 66.3,18.41 66.7,18.41 68,17.11 69,17.11 | R1.1 68.6,17.51 69,17.11 | C52.1 70.8,28.31 71,28.11 | v63,13.06 62.6,13.06 | 62.6,13.06 R10.1 | C13.1 43.5,6.46 42.7,7.26 42.7,8.76 | 42.7,8.76 42.55,8.91 41.95,8.91 41.75,9.11 R16.2 | ITG3.13 46.75,13.81 47.15,14.21 47.15,14.76 v47.4,15.01 | 54.25,16.31 53.75,16.31 v52.5,15.06 | 55.98,7.74 54.62,7.74 L3G_1.15 L3G_1.16 | 50,12.26 48.15,12.26 48,12.11 48,11.33 ACL_5.1
  Top 0.254: ACL_5.14 50,12.26 | v5,5.61 3.55,5.61 3.5,5.66 | 50.6,18.01 C8.1 50.8,18.01 v52.5,18.01 | 48,3.11 v48,4.91 | v46,4.91 44.8,6.11 44,6.11 | 44,6.11 43.45,6.11 | C13.1 43.85,5.96 44,6.11 | 61.5,34.61 61,34.11 61,33.11 59,31.11 59,29.98 L3G_2.5 L3G_2.16 | ACL_6.14 43.35,32.21 | 43.35,32.21 43.35,32.91 43.2,32.91 43,33.11 43,34.41 42.65,34.76 42.15,34.76 42.15,35.11 R32.2 40.6,34.76 40,34.16 40,34.11 39,34.11 | 26.5,33.11 26.5,33.61 26,34.11 25,34.11 | 38.05,35.16 38.05,35.06 39,34.11 | C51.1 38.05,35.16 | 38.05,35.16 v38,35.11 37,35.11 36.45,34.56 C34.1 | ITG2.13 34.7,27.81 | 34.7,27.81 35.55,27.81 C35.1 | v34.8,26.61 34.8,27.71 34.7,27.81 | C40.1 32.6,38.11 | C47.1 30.9,38.01 31,38.11 | L3G_2.1 L3G_2.16 | R5.2 39.05,20.16 39,20.11 | v31.5,39.56 31.5,39.61 31,40.11 30,40.11 | R31.2 22,31.86 v22,33.11 | MPU1.13 25.81,7.3 v26.45,6.41 | MPU1.8 21.98,4.83 v22.45,4.36 R14.2 | 18,12.86 18,13.36 18.55,13.91 R9.1 | R17.2 16.35,3.21 16.45,3.11 | R6.2 7.9,3.21 8,3.11 | R4.2 10.05,3.16 10,3.11 | 3.5,16.76 3.6,16.86 7.3,16.86 7.5,16.86 7.85,17.21 R40.2 | C48.1 39,33.86 39,34.11 | 18.1,32.16 18,32.26 v18,33.11 | C46.1 14,36.11 | ITG1.8 34.7,5.71 33.25,4.26 R18.2 | 16,17.01 17.25,17.01 v17.5,17.26 | C49.1 12.15,35.96 12,36.11 12,35.96 C49.1
  Top 0.406: v60,36.11 55,36.11 51,36.11 49,36.11 44,36.11 42,38.11 32.6,38.11 31,38.11 30,38.11 | 25,36.11 21,36.11 | 21,36.11 15,36.11 14,36.11 12,36.11 | 8,26.11 8,23.81 R28.1 | 59.4,3.11 59,3.11 48,3.11 29.7,3.11 22.4,3.11 16.45,3.11 10,3.11 8,3.11 3.5,3.11 3.5,5.66 3.5,16.76 3.5,46.11 21,46.11 | 59.4,3.11 59.4,4.21 | 71,23.66 71,28.11 71,34.11 71,36.11 v66,36.11 | 30,38.11 30,40.11 IC1.2 | 21,46.11 74.5,46.11 74.5,3.11 59.4,3.11 | 8,26.11 8,28.11 8,36.11 v8,36.91 | 8,26.11 8.15,26.11 R2.1 | 21,46.11 v21,43.11 | v21,38.11 21,36.11 | v10,36.91 11.1,36.91 C49.1 | 30,38.11 C50.1
  Bottom 0.254: 50.7,23.26 50.7,22.86 50,22.11 | v46.35,24.81 46,24.81 46,23.26 50.7,23.26 | 50.7,23.26 v50.7,24.51 | 21,19.66 21,20.11 24,23.11 27,23.11 | 21,19.66 21,18.11 20,17.11 17.65,17.11 v17.5,17.26 | v22.65,19.66 21,19.66 | 50,22.11 52.5,19.61 v52.5,18.01 v52.5,15.06 52.45,15.01 v47.4,15.01 | v48,4.91 v46,4.91 | 50,22.11 45,22.11 44,23.11 38.6,23.11 | 38.6,23.11 27,23.11 | v27.35,21.91 27.35,22.76 27,23.11 | v38.6,22.11 38.6,23.11 | v34.8,26.61 35.65,26.61 36.5,27.46 36.5,33.61 v38,35.11 33.55,39.56 v31.5,39.56 29,37.06 v29,35.11 24,35.11 v22,33.11 v18,33.11 | 60.02,36.09 v60,36.11 | v66,34.11 v66,36.11 | v10,36.91 v8,36.91 | v26.45,6.41 26.4,6.36 24,6.36 22.45,4.81 v22.45,4.36 21.2,5.61 v5,5.61 5,6.11 6,7.11 13,7.11 17.15,11.26 v17.15,12.86 16.25,12.86 15,14.11 15,14.76 v17.5,17.26 | v63,13.06 63,14.61 v64.15,15.76 | 17.25,17.01 v17.5,17.26
  Bottom 0.406: v60,36.11 v66,36.11 | v21,43.11 v21,38.11
B1_SC0  (via drill 0.6)
  Top 0.254: MUX1.5 63.7,23.03 63.7,21.36 v63.25,21.36 | ITG1.23 34.7,12.11 v35.4,12.76 | v23,12.11 22.45,12.11 22,11.66 21.98,11.66 MPU1.23 | R9.2 20.9,14.01 22,15.11 v23,15.11
  Bottom 0.254: v63.25,21.36 54.65,21.36 54,20.71 54,19.11 56,17.11 56,15.11 55,14.11 37.45,14.11 37.23,14.33 | 37.23,14.33 34.45,17.11 31,17.11 26.7,12.81 23.7,12.81 v23,12.11 v23,15.11 | v35.4,12.76 35.95,12.76 37.23,14.33
B1_SC1
  Top 0.254: ITG3.23 43.2,17.23 43.2,18.46 43.7,18.96 53.4,18.96 54.6,17.76 58.35,17.76 | 62.4,23.03 MUX1.7 62.35,23 62.35,22.06 62,21.71 62,21.11 60,21.11 59.05,20.16 59.05,18.46 58.35,17.76 | 55.88,9.81 L3G_1.2 | 55.88,9.76 L3G_1.2 | 58.35,17.76 59,17.11 59,16.11 60,16.11 60.3,15.81 60.3,13.66 59.55,12.91 59.55,12.31 R8.2 59.45,12.01 57.2,9.76 56.17,9.76 L3G_1.2
B1_SC2  (via drill 0.6)
  Top 0.2: R5.1 41.95,19.51 41.55,19.11 40.15,19.11 39.85,18.81 39.85,15.46 MAG1.7
  Top 0.254: L3G_3.2 64.67,7.79 65.6,8.71 65.6,11.71 66.5,12.61 66.5,13.96 66,14.46 64.15,14.46 62.4,16.21 62.4,17.17 MUX1.10 62.4,17.22 62.4,18.21 62.9,18.21 v64.2,20.11 | v57,20.46 43,20.46 42.7,20.16 R5.1
  Bottom 0.254: v64.2,20.11 62.85,20.11 62.7,20.46 v57,20.46
B1_SD0  (via drill 0.6)
  Top 0.254: MUX1.4 64.33,21.48 v65.6,20.71 | v33,16.06 31.8,17.11 29.45,17.11 29,16.66 R7.2 26.9,15.66 24.95,13.71 23,13.71 21.47,12.18 MPU1.24 | ITG1.24 34.19,13.1 v34.2,13.31
  Bottom 0.254: v65.6,20.71 65.6,14.36 62.35,11.11 57,11.11 55.55,12.56 42.45,12.56 39.7,9.81 34.3,9.81 33,11.11 33,13.31 | 33,13.31 v33,16.06 | 33,13.31 v34.2,13.31
B1_SD1  (via drill 0.6)
  Top 0.254: ITG3.24 42.73,18.69 43.5,19.46 53.8,19.46 54.6,18.66 v57.8,18.66 58.3,18.66 58.3,22.26 60.15,24.11 v60.8,24.11 | 63,23.03 MUX1.6 63,23.05 63,25.01 v62.85,25.11 | 55.88,10.41 L3G_1.3 56.17,10.41 56.85,10.41 57.05,10.61 57.05,12.56 58.17,13.68 | R10.2 59,14.51 58.17,13.68 | v58,12.11 58.25,12.11 58.4,12.26 58.4,13.46 58.17,13.68
  Bottom 0.254: v57.8,18.66 57.8,12.31 v58,12.11 | v60.8,24.11 61,24.11 62,25.11 v62.85,25.11
B1_SD2  (via drill 0.6)
  Top 0.2: MAG1.6 40.5,15.06 40.5,17.91 R3.1
  Top 0.254: MUX1.9 61.7,17.19 | MUX1.9 61.7,17.22 61.7,18.86 v61,19.56 | v55.6,19.56 55.15,19.96 43.3,19.96 42.2,18.86 42.2,18.11 R3.1 40.6,18.16 | MUX1.9 61.73,16.13 63.95,13.86 65.55,13.86 65.8,13.61 65.8,12.91 65,12.11 65,8.86 64.58,8.43 L3G_3.3
  Bottom 0.254: v61,19.56 v55.6,19.56
B2_SC0  (via drill 0.6)
  Top 0.254: MUX2.5 13.7,25 13.7,22.51 13.9,22.31 18.3,22.31 v18.9,21.71 | ITG2.23 31.24,31.23 31.24,32.15 v31.8,32.71 | 13.7,25.05 MUX2.5 | MPU2.23 22.64,25.75 23,26.11 v23,27.11 | R28.2 10,23.81 10,25.06 10.75,25.06 10.75,26.36 11.6,26.36 11.8,27.26 13.68,27.26 MUX2.5
  Bottom 0.254: v18.9,21.71 20.3,23.11 22,23.11 22,26.11 v23,27.11 23,28.21 24.45,29.66 31.55,29.66 33,31.11 33,31.51 v31.8,32.71
B2_SC1  (via drill 0.6)
  Top 0.254: 47.2,30.25 ITG4.23 47.2,30.23 47.2,30.25 | MUX2.7 12.38,21.73 13,21.11 16.8,21.11 16.8,18.56 17.2,18.16 18.95,18.16 19.4,17.71 26.7,17.71 31.3,22.31 35.4,22.31 37.65,24.56 40.15,24.56 41.95,22.76 47.6,22.71 48,23.11 53,23.11 | L3G_2.2 60.58,27.79 61,27.36 61,26.51 58.5,24.01 54.55,24.01 53.65,23.11 53,23.11 | 47.2,30.25 47.2,32.06 48.25,33.11 49.65,33.11 R29.2 R24.2 53,33.26 v52.6,32.86 | v52.6,24.46 52.6,23.51 53,23.11
  Bottom 0.254: v52.6,24.46 v52.6,32.86
B2_SC2  (via drill 0.6)
  Top 0.2: v10,17.11 9,17.11 7.7,15.81 MAG2.7 7.7,14.11 9.05,14.11
  Top 0.254: 12.4,19.17 MUX2.10 12.38,18.11 | L3G_4.2 65.88,29.81 67.05,29.81 67.5,30.26 v69,30.26 | v55,23.11 54.4,22.51 48.35,22.51 47.95,22.11 41.8,22.11 39.85,24.06 37.9,24.06 35.65,21.81 31.55,21.81 26.95,17.21 20.5,17.21 19.65,16.36 13.25,16.36 12.38,17.23 12.38,18.11 | v13.4,17.91 12.4,17.91 12.4,18.09 12.38,18.11 | 9.05,14.11 9.05,9.11 7.9,7.96 R6.1
  Bottom 0.254: v69,30.26 69,30.11 70,29.11 70,27.11 68,25.11 65.2,25.11 62.2,22.11 56.8,22.11 55.8,23.11 v55,23.11 | v13.4,17.91 13.7,17.61 13.7,15.81 11.3,15.81 v10,17.11
B2_SD0  (via drill 0.6)
  Top 0.254: MUX2.4 14.3,25 14.3,22.81 18,22.81 18.6,23.41 v18.6,23.71 | 30.73,31.38 ITG2.24 30.1,31.68 | R23.2 30.1,31.68 | 30.1,31.68 v29.11,31.68 | MPU2.24 22.13,25.98 22,26.11 v20,26.11
  Bottom 0.254: v18.6,23.71 20,23.71 v20,26.11 25.57,31.68 v29.11,31.68
B2_SD1  (via drill 0.6)
  Top 0.254: L3G_2.3 61.17,28.43 62.05,27.56 v62.05,26.86 | MUX2.6 13.03,21.98 13.3,21.71 17.3,21.71 17.3,19.11 17.7,18.71 19.35,18.71 19.8,18.26 26.5,18.26 31.1,22.86 35.15,22.86 37.35,25.06 40.4,25.06 42.15,23.31 47.3,23.31 47.7,23.71 48.85,23.71 v48.85,24.16 | v58.1,32.01 58.1,33.66 57.85,33.91 R27.2 56.7,34.61 56.35,34.26 R25.2 | v46.5,33.11 46.5,31.31 46.7,31.06 46.7,30.22 ITG4.24
  Bottom 0.254: v48.85,24.16 48.85,28.26 45,32.11 45,33.11 | 45,33.11 47,35.11 55,35.11 v58.1,32.01 60.1,32.01 60.1,28.16 61.4,26.86 v62.05,26.86 | 45,33.11 v46.5,33.11
B2_SD2  (via drill 0.6)
  Top 0.2: MAG2.6 8.1,15.56 8.2,15.66 8.45,15.66 9.5,14.61
  Top 0.254: L3G_4.3 66.47,30.43 v68.15,32.11 | v57.2,23.11 55.95,21.86 48.6,21.86 48.3,21.56 41.6,21.56 39.65,23.51 38.05,23.51 35.8,21.26 31.7,21.26 27.15,16.71 20.9,16.71 20,15.86 12.25,15.86 11.5,16.61 | MUX2.9 11.7,19.17 11.7,16.81 11.5,16.61 | 11.5,16.61 9.5,14.61 11,13.11 11,9.11 10.05,8.16 R4.1
  Bottom 0.254: v68.15,32.11 67,32.11 66,31.11 66,26.11 65.45,26.11 62.4,23.06 v57.2,23.11
CLK1
  Top 0.254: MUX1.14 64.97,16.13 66,15.11 72,15.11 73.5,16.61 73.5,38.61 46.45,38.61 45.35,39.71 45.35,40.96 P1.P1_5
CLK2  (via drill 0.6)
  Top 0.254: R40.1 6.15,19.11 v5,19.11 5,23.81 5.1,23.91 6.9,23.91 7,24.01 7,26.11 6,27.11 6,38.26 15.2,38.26 P5.P5_6 | v15.35,17.91 14.97,17.91 MUX2.14
  Bottom 0.254: v5,19.11 5,20.11 14,20.11 15.35,18.76 v15.35,17.91
GND  (via drill 0.6)
  Top 0.254: C46.2 C49.2 9.85,34.26 C24.2 C14.2 C21.2 C23.2 10.7,28.31 11.05,28.56 13.7,28.56 14.25,29.11 15.5,29.11 | ACL_2.12 17.6,30.61 17.6,29.61 | 17.6,29.61 ACL_2.10 19.7,29.61 19.7,28.76 | ITG2.1 29.26,30.37 29,30.11 28.3,30.11 28,30.46 27.85,30.61 ACL_4.10 | L3G_4.12 L3G_4.11 L3G_4.10 L3G_4.9 60.42,31.09 | 60.4,29.71 61,29.11 59.88,29.11 L3G_2.4 | L3G_2.8 57.02,32.04 R26.1 | L3G_2.9 L3G_2.10 L3G_2.11 L3G_2.12 | L3G_3.12 L3G_3.11 L3G_3.10 L3G_3.9 | 18.02,9.46 ACL_1.12 | C22.2 11.6,12.31 11.6,9.56 11.65,9.51 11.65,9.46 12,9.11 12.45,9.11 C19.2 12.15,9.26 11.55,8.66 11.55,6.21 11.95,5.81 12.55,5.81 C26.2 12.5,5.86 | MPU1.18 | 15.45,7.94 ACL_1.5 | ACL_2.7 17.6,29.61 | ACL_2.5 15.5,29.11 | 15.5,29.11 15.5,28.31 16,27.81 | 36.24,6.37 v38.25,6.36 | C17.2 39.2,8.41 v39.5,8.11 | ITG3.11 44.78,12.43 45.25,11.96 45.25,11.66 C11.2 | ACL_3.5 28.73,7.89 v28.95,7.36
  Bottom 0.254: v39.5,8.11 39,7.11 v38.25,6.36 | v28.95,7.36 29.05,7.41 29.1,7.36
  pour Top: 0,49.11 78,49.11 78,0.11 0,0.11
  pour Bottom: 0,49.11 78,49.11 78,0.11 0,0.11
  pour Top: 0,49.11 78,49.11 78,0.11 0,0.11
I1_AUXCLK
  Top 0.254: ACL_3.4 28.1,9.61 27.95,9.46 27.95,6.56 28.5,6.01 29.5,6.01 R15.1 30.5,5.96 30.9,5.56 30.9,5.11 33.35,5.11 34.19,5.95 ITG1.7
I1_AUXSDA
  Top 0.254: 32.2,7.21 32.2,7.31 33,8.11 33.49,8.11 ITG1.6 | R18.1 32.2,7.21 | ACL_3.6 29.5,8.26 29.8,7.96 31.35,7.96 32.1,7.21 32.2,7.21
I2_AUXCLK  (via drill 0.6)
  Top 0.254: 30.71,27.01 ITG2.7 30.7,26.95 30.7,25.56 30.5,25.36 28.85,25.36 28.65,25.61 28.65,26.61 28.45,26.81 27.7,26.81 v26.9,27.61 | R31.1 22.9,30.06 | 22.9,30.06 23.45,30.61 ACL_4.4 | v25,27.61 24.6,27.61 22.9,29.31 22.9,30.06
  Bottom 0.254: v26.9,27.61 v25,27.61
I2_AUXSDA
  Top 0.254: ITG2.6 29.4,27.81 29.35,27.76 | 29.35,27.76 29,28.11 28,28.11 27.35,28.76 25.8,28.76 25.5,29.06 ACL_4.6 | 29.35,27.76 29.55,27.56 R34.1
I3_AUXCLK  (via drill 0.6)
  Top 0.254: ITG3.7 42.73,12.38 | 42.73,12.38 43.15,11.96 v43.15,10.51 | R16.1 41.75,12.01 42.1,12.36 42.72,12.36 42.73,12.38 | v46,7.11 47.4,8.51 47.4,9.41 47.6,9.61 ACL_5.4
  Bottom 0.254: v43.15,10.51 43.15,8.96 45,7.11 v46,7.11
I3_AUXSDA  (via drill 0.6)
  Top 0.254: 41.75,13.81 ITG3.6 41.1,13.81 40.8,13.51 | v41,8.11 40.75,8.51 40.75,13.31 40.8,13.51 | R19.1 40.8,13.51 | ACL_5.6 49,7.16 v48.8,6.96
  Bottom 0.254: v41,8.11 43.2,5.91 47.75,5.91 v48.8,6.96
I4_AUXCLK  (via drill 0.6)
  Top 0.254: 46.73,25.84 ITG4.7 46.53,25.99 46.4,25.81 43.2,25.81 v43.05,25.96 | 39.35,30.11 39.35,32.71 39.6,32.96 41.65,32.96 R32.1 | ACL_6.4 41,29.61 40.4,29.36 39.65,29.36 39.35,29.61 39.35,30.11 | v40.15,30.26 39.65,30.26 39.35,30.11
  Bottom 0.254: v40.15,30.26 41.1,30.26 41.45,29.91 41.45,27.56 v43.05,25.96
I4_AUXSDA
  Top 0.254: ITG4.6 45.25,26.81 45.1,26.66 R35.1 44.1,26.66 43.4,27.36 42.9,27.36 42.35,27.91 ACL_6.6
M1_AUXCLK  (via drill 0.6)
  Top 0.254: ACL_1.4 14.55,8.45 14.55,5.21 v13.95,4.61 | 18.95,4.61 R14.1 | MPU1.7 21.45,6.46 21.45,5.51 21.2,5.26 19.3,5.26 19.1,5.06 19.1,4.46 R14.1 | 19.05,4.46 R14.1 | v17.7,4.61 18.9,4.61 R14.1
  Bottom 0.254: v13.95,4.61 v17.7,4.61
M1_AUXSDA
  Top 0.254: MPU1.6 20.19,7.3 19,6.11 16.7,6.11 R17.1 16.24,5.87 ACL_1.6
M2_AUXCLK  (via drill 0.6)
  Top 0.254: MPU2.7 22.15,20.97 22.11,20.97 21.75,20.61 19.6,20.61 v18.9,19.91 | ACL_2.4 v13,29.61 12.4,29.61 10.9,31.11 10.9,33.31 16.2,33.31 16.25,33.36 R30.1
  Bottom 0.254: v18.9,19.91 18.2,19.91 13,25.11 v13,29.61
M2_AUXSDA
  Top 0.254: R33.1 19.65,32.46 20.2,32.01 20.2,28.11 19.65,27.56 18.4,27.56 | ACL_2.6 17.1,27.56 18.4,27.56 | MPU2.6 20.45,21.81 20.45,23.66 18.5,25.61 18.5,27.46 18.4,27.56
N$1
  Top 0.254: MPU1.20 23.52,11.23 23.8,11.61 26.1,11.61 26.5,11.21 C16.1
N$2
  Top 0.254: 23,6.48 MPU1.10 23.02,5.14 23.8,4.36 C6.1
N$3
  Top 0.254: C26.1 13.85,7.56 13.85,9.45 ACL_1.2
N$5
  Top 0.254: ACL_2.2 12.4,30.61 11.8,31.21 11.8,32.06 C53.1
N$6
  Top 0.254: MPU2.20 24.18,26.21 24.8,26.21 25.55,25.46 C43.1
N$7  (via drill 0.6)
  Top 0.254: C33.1 v17.15,14.71 | MPU2.10 23.68,19.48 24,19.16 v24.45,19.16
  Bottom 0.254: v17.15,14.71 17.15,15.26 18,16.11 21.4,16.11 v24.45,19.16
N$9
  Top 0.254: 29.3,10.61 ACL_3.2 27.9,10.61 27.9,12.21 27,13.11 27,13.16 C27.1
N$10
  Top 0.406: P1.P1_2 36.5,43.52 36.5,42.71 36.1,42.31 IC1.3
N$13
  Top 0.254: 35.8,4.66 C10.1 35.85,5.36 35.75,5.46 35.75,7.27 ITG1.10
N$14
  Top 0.254: 36.24,11.53 ITG1.20 36.25,11.49 36.25,12.16 36.45,12.36 37.1,12.36 37.3,12.16 38,12.16 38.8,11.36 38.8,11.31 39.3,11.31 C17.1
N$15
  Top 0.254: C54.1 23.85,33.86 23.4,33.41 23.4,31.91 23.7,31.61 ACL_4.2
N$16
  Top 0.254: R2.2 10,26.01 10,26.86 11.2,26.86 11.3,27.46 11.4,27.76 14.2,27.76 14.95,27.01 14.97,27.01 MUX2.3
N$20
  Top 0.254: ITG2.10 32.28,25.23 C37.1
N$21
  Top 0.254: 35.65,33.11 C44.1 35.3,33.11 33.4,33.11 32.8,32.51 32.8,31.21 ITG2.20
N$23
  Top 0.254: ACL_5.2 47.7,10.59 47.45,10.84 47.45,12.41 48.45,13.41 C28.1
N$27
  Top 0.254: ITG3.10 44.28,12.28 44.6,11.96 44.6,9.76 C11.1
N$28
  Top 0.254: 44.8,17.21 ITG3.20 44.75,17.22 44.75,18.16 44.85,18.26 48.5,18.26 C18.1
N$30  (via drill 0.6)
  Top 0.254: v40.35,31.71 40.75,31.31 40.75,30.91 41.05,30.61 ACL_6.2 | C55.1 39.2,28.81 v40,28.01
  Bottom 0.254: v40.35,31.71 38.6,31.71 38,31.11 38,28.31 39.05,27.31 v40,28.01
N$34
  Top 0.254: C38.1 43.05,23.91 46.7,23.91 48.25,25.46 48.28,25.46 ITG4.10
N$35
  Top 0.254: C45.1 48.78,31.69 ITG4.20
N$36
  Top 0.254: 61.65,6.26 L3G_3.14 61.6,6.19 61.6,4.16 70.7,4.16 72,5.46 72,11.91 C30.1 69.85,11.16 69.4,10.71 67.35,10.71 67.05,10.41 C31.1
N$38
  Top 0.2: C2.1 5,13.2 MAG2.1
N$39
  Top 0.254: C15.1 53.4,6.46 53.12,6.74 | 53.12,6.74 52.85,6.96 51.95,6.96 C12.1 | 53.12,6.74 53.7,7.46 54,7.46 54,8.23 L3G_1.14
N$40
  Top 0.254: R11.2 55.25,5.56 C15.2
N$41
  Top 0.254: C31.2 R22.2
N$42
  Top 0.254: MUX1.3 64.97,21.84 65,21.81 67,21.81 67.85,20.96 R1.2
N$45
  Top 0.254: 54.75,28.11 54.75,25.11 57.6,25.11 57.6,26.26 L3G_2.14 | 54.75,28.11 54.75,28.66 54.4,29.01 52.25,29.01 52.05,29.21 C42.1 | C39.1 54.65,28.01 54.75,28.11
N$46
  Top 0.254: R26.2 55,31.96 54.1,31.96 53.75,31.61 C42.2
N$49
  Top 0.2: 7.05,11.96 7.7,12.61 MAG2.4
  Top 0.254: C4.1 7.05,11.96
N$50
  Top 0.254: L3G_4.14 63.67,27.43 63.8,27.31 64.7,27.31 C57.1 C58.1
N$51
  Top 0.254: R38.2 C58.2
N$52
  Top 0.2: MAG1.1 36.05,16.66 35.5,17.21 C1.1
N$53
  Top 0.2: C3.1 34,17.31 35.85,15.46 MAG1.4
SDA1
  Top 0.254: MUX1.15 65.62,16.48 66,16.11 71,16.11 72.5,17.61 72.5,37.61 44.35,37.61 42.8,39.16 P1.P1_3
SDA2  (via drill 0.6)
  Top 0.254: v10.95,22.01 10.95,20.51 15.62,20.51 MUX2.15 | R39.1 v5,26.11 5,45.11 15.19,45.11 P5.P5_5
  Bottom 0.254: v5,26.11 10.95,23.11 v10.95,22.01

### Text on the board
tNames: PA Consulting - Gyro Intern Project - Summer 2013